# EAGLE design ibmpc (EAGLE 9.6.1)
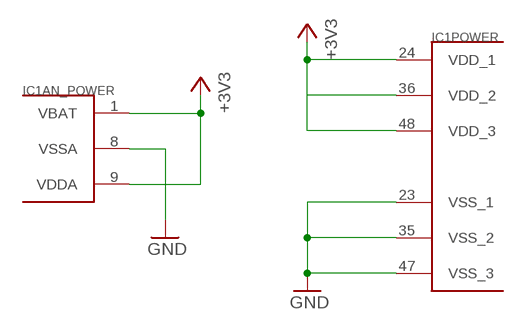
[diagram p0: schematic, sheet 1, part 1 of 2]
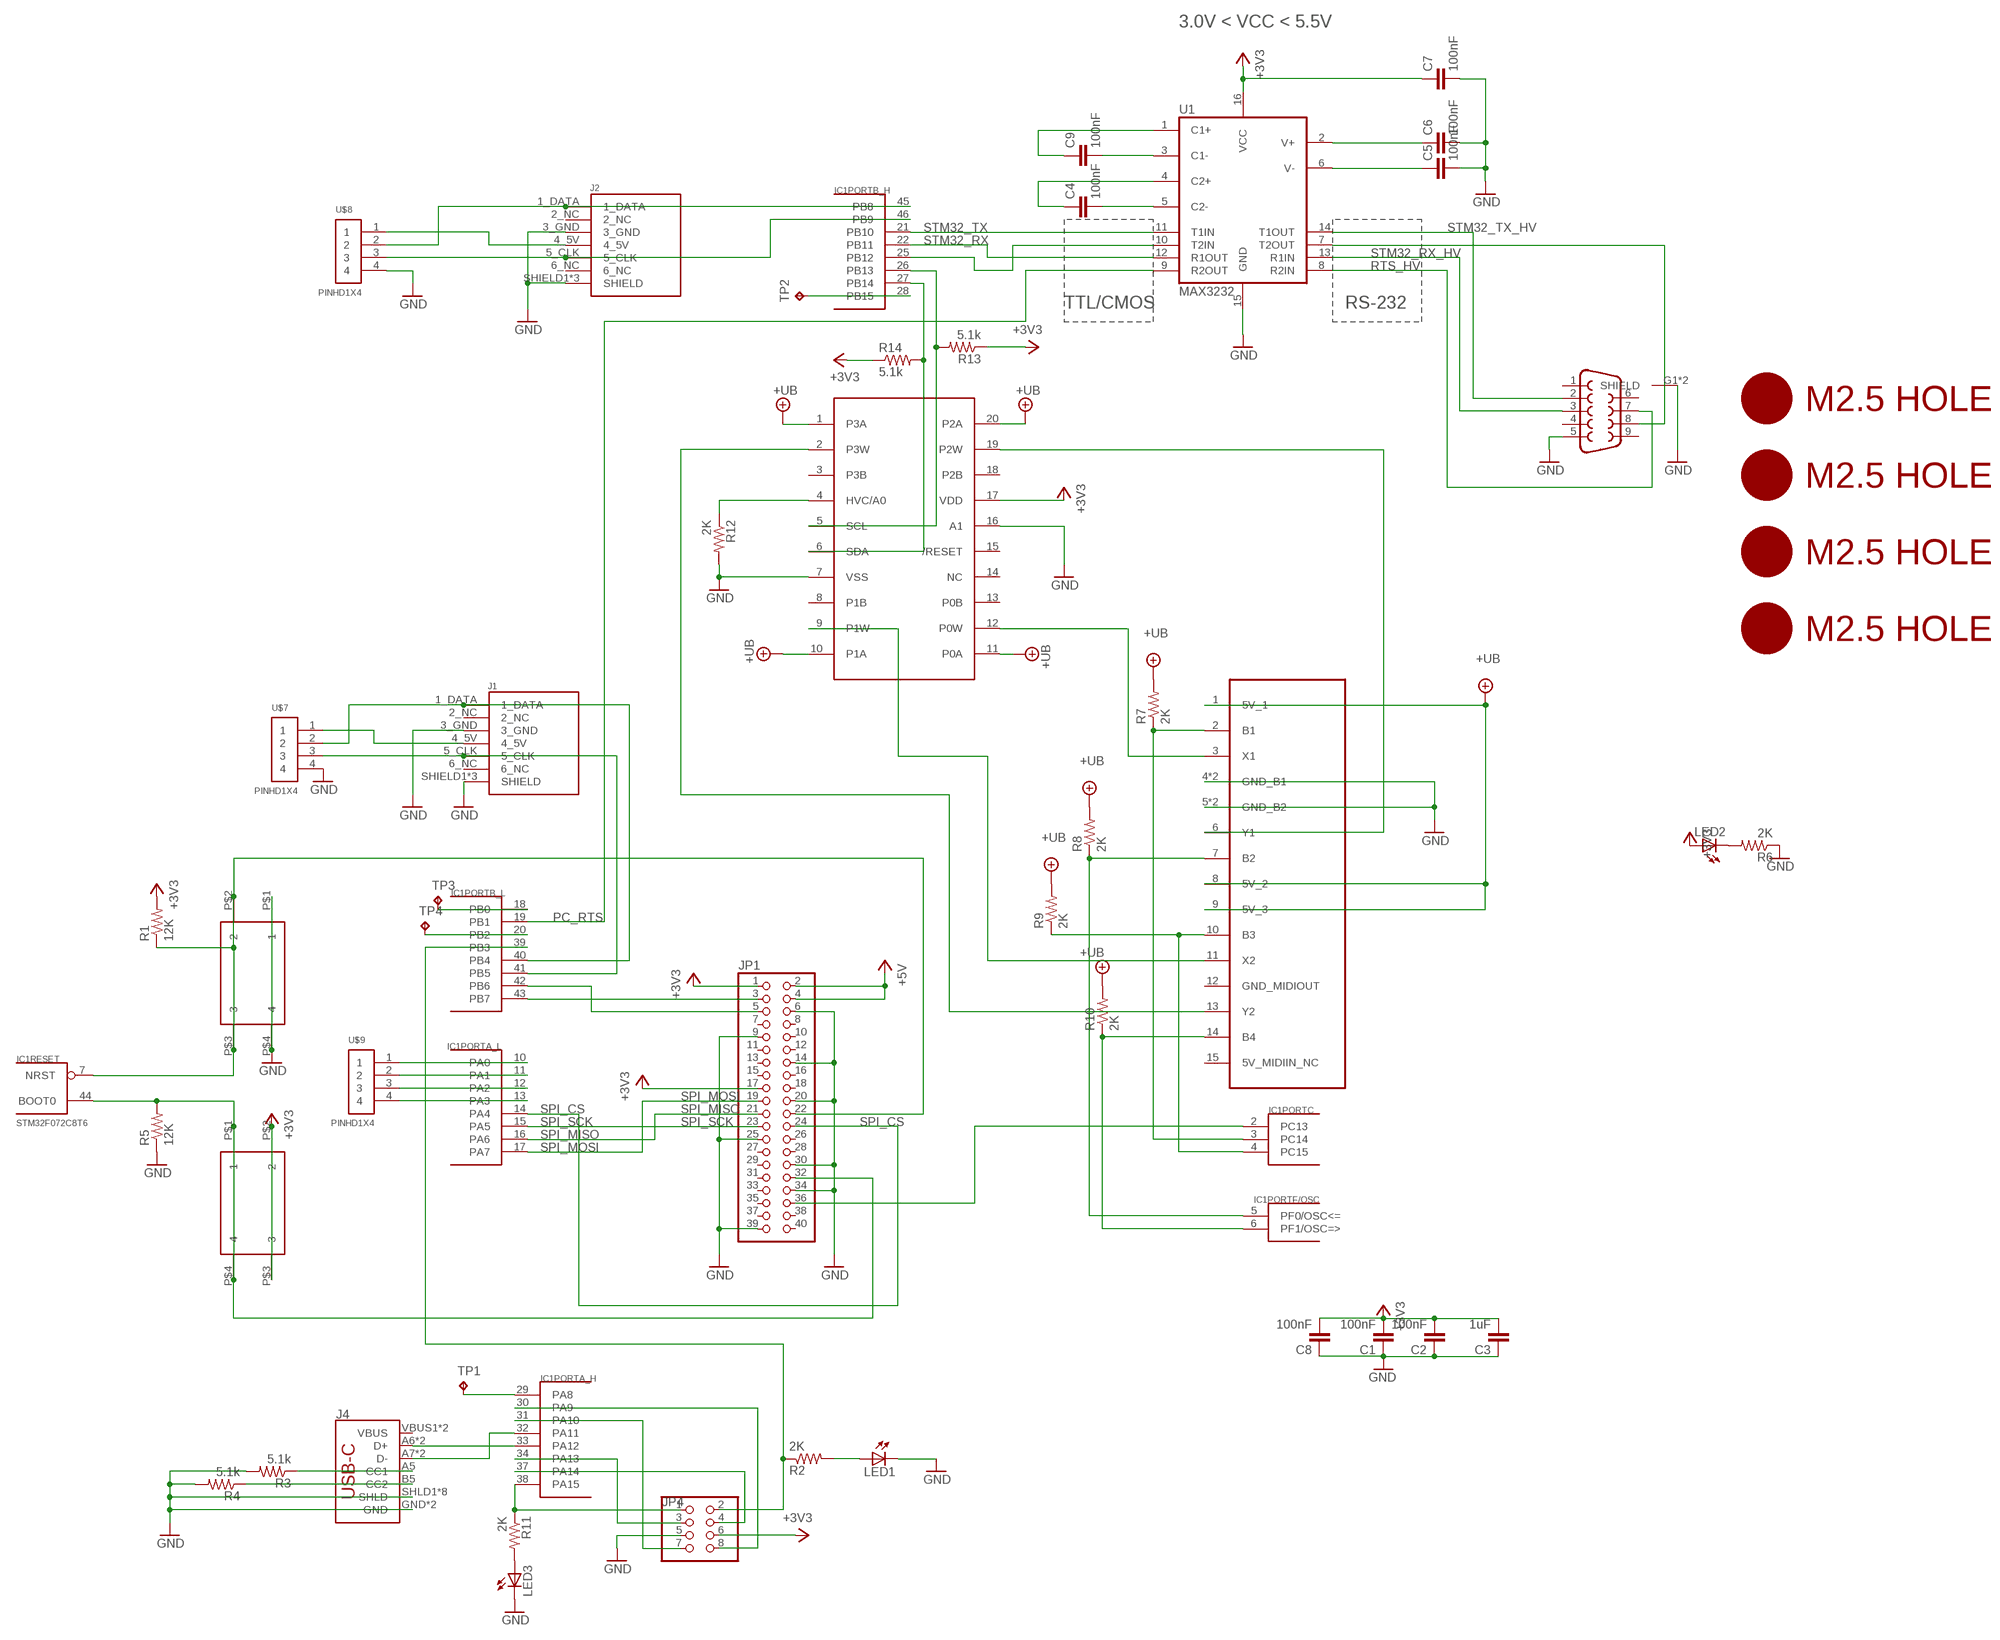
[diagram p1: schematic, sheet 1, part 2 of 2]

## Parts
C1  100nF  CAP0805  [0805@1]
C2  100nF  CAP0805  [0805@1]
C3  1uF  CAP0805  [0805@1]
C4  100nF  CAP0805  [0805@1]
C5  100nF  CAP0805  [0805@1]
C6  100nF  CAP0805  [0805@1]
C7  100nF  CAP0805  [0805@1]
C8  100nF  CAP0805  [0805@1]
C9  100nF  CAP0805  [0805@1]
IC1  STM32F072C8T6  [TQFP48]
J1  DIN7  [DIN7]
J2  DIN7  [DIN7]
J3  DB9MALE  [DB9_MALE]
J4  USB_C16PIN  [USB-C-16P]
JP1  PINHD-2X20-BIG  [2X20-BIG]
JP4  PINHD-2X4  [2X04]
LED1  LEDCHIP-LED0805  [CHIP-LED0805]
LED2  LEDCHIP-LED0805  [CHIP-LED0805]
LED3  LEDCHIP-LED0805  [CHIP-LED0805]
R1  12K  RESISTOR0805-RES  [0805]
R2  2K  RESISTOR0805-RES  [0805]
R3  5.1k  RESISTOR0805-RES  [0805]
R4  5.1k  RESISTOR0805-RES  [0805]
R5  12K  RESISTOR0805-RES  [0805]
R6  2K  RESISTOR0805-RES  [0805]
R7  2K  RESISTOR0805-RES  [0805]
R8  2K  RESISTOR0805-RES  [0805]
R9  2K  RESISTOR0805-RES  [0805]
R10  2K  RESISTOR0805-RES  [0805]
R11  2K  RESISTOR0805-RES  [0805]
R12  2K  RESISTOR0805-RES  [0805]
R13  5.1k  RESISTOR0805-RES  [0805]
R14  5.1k  RESISTOR0805-RES  [0805]
SW1  324_SW  [342_SWICH_FOOT]
SW4  324_SW  [342_SWICH_FOOT]
TP1  TPTP12R  [TP12R]
TP2  TPTP12R  [TP12R]
TP3  TPTP12R  [TP12R]
TP4  TPTP12R  [TP12R]
U1  MAX3232  MAX232SOIC16  [SO016]
U$1  GAMEPORT_15P  [DA15]
U$2  M2.5HOLE  [M2.5HOLE]
U$3  M2.5HOLE  [M2.5HOLE]
U$4  M2.5HOLE  [M2.5HOLE]
U$5  M2.5HOLE  [M2.5HOLE]
U$6  MCP4451  [TSSOP20]
U$7  PINHD1X4  [1X04-CLEANBIG]
U$8  PINHD1X4  [1X04-CLEANBIG]
U$9  PINHD1X4  [1X04-CLEANBIG]

## Nets
+3V3: C1.2 C2.2 C3.2 C7.1 C8.2 IC1.1(AN_POWER:VBAT) IC1.9(AN_POWER:VDDA) IC1.24(POWER:VDD_1) IC1.36(POWER:VDD_2) IC1.48(POWER:VDD_3) JP1.1 JP1.17 JP4.6 LED2.A R1.2 R13.1 R14.1 SW1.P$2 SW1.P$3 U1.16(VCC) U$6.17(VDD)
+5V: JP1.2 JP1.4
+UB: R7.2 R8.2 R9.2 R10.2 U$1.1(5V_1) U$1.8(5V_2) U$1.9(5V_3) U$6.1(P3A) U$6.10(P1A) U$6.11(P0A) U$6.20(P2A)
C1+: C9.1 U1.1(C1+)
C1-: C9.2 U1.3(C1-)
C2+: C4.1 U1.4(C2+)
C2-: C4.2 U1.5(C2-)
GND: C1.1 C2.1 C3.1 C5.2 C6.2 C7.2 C8.1 IC1.8(AN_POWER:VSSA) IC1.23(POWER:VSS_1) IC1.35(POWER:VSS_2) IC1.47(POWER:VSS_3) J1.3_GND J1.SHIELD1(SHIELD) J1.SHIELD2(SHIELD) J1.SHIELD3(SHIELD) J2.3_GND J2.SHIELD1(SHIELD) J2.SHIELD2(SHIELD) J2.SHIELD3(SHIELD) J3.5 J3.G1(SHIELD) J3.G2(SHIELD) J4.GND J4.GND2(GND) J4.SHLD1(SHLD) J4.SHLD2(SHLD) J4.SHLD3(SHLD) J4.SHLD4(SHLD) J4.SHLD5(SHLD) J4.SHLD6(SHLD) J4.SHLD7(SHLD) J4.SHLD8(SHLD) JP1.6 JP1.9 JP1.14 JP1.20 JP1.25 JP1.30 JP1.34 JP1.39 JP4.5 LED1.C LED3.C R3.2 R4.2 R5.1 R6.1 R12.2 SW4.P$1 SW4.P$4 U1.15(GND) U$1.4(GND_B1) U$1.5(GND_B2) U$1.G1(GND_B1) U$1.G2(GND_B2) U$6.7(VSS) U$6.16(A1) U$7.4 U$8.4
N$1: J4.A5(CC1) R3.1
N$2: LED1.A R2.2
N$3: J1.4_5V U$7.1
N$4: J2.4_5V U$8.1
N$5: IC1.41(PORTB_L:PB5) J1.5_CLK U$7.3
N$6: IC1.39(PORTB_L:PB3) JP4.2 R2.1
N$7: J4.B5(CC2) R4.1
N$8: IC1.33(PORTA_H:PA12) J4.A6(D+) J4.B6(D+)
N$9: IC1.32(PORTA_H:PA11) J4.A7(D-) J4.B7(D-)
N$10: IC1.45(PORTB_H:PB8) J2.1_DATA U$8.2
N$11: IC1.46(PORTB_H:PB9) J2.5_CLK U$8.3
N$12: IC1.31(PORTA_H:PA10) JP4.7
N$13: IC1.7(RESET:NRST) JP1.22 R1.1 SW4.P$2 SW4.P$3
N$14: IC1.30(PORTA_H:PA9) JP4.8
N$15: IC1.34(PORTA_H:PA13) JP4.3
N$16: IC1.37(PORTA_H:PA14) JP4.4
N$17: IC1.3(PORTC:PC14) R7.1 U$1.2(B1)
N$18: IC1.44(RESET:BOOT0) JP1.32 R5.2 SW1.P$1 SW1.P$4
N$19: IC1.5(PORTF/OSC:PF0/OSC<=) R8.1 U$1.7(B2)
N$20: IC1.4(PORTC:PC15) R9.1 U$1.10(B3)
N$21: IC1.6(PORTF/OSC:PF1/OSC=>) R10.1 U$1.14(B4)
N$22: IC1.42(PORTB_L:PB6) JP1.5
N$23: IC1.43(PORTB_L:PB7) JP1.3
N$24: IC1.25(PORTB_H:PB12) U1.10(T2IN)
N$25: J3.8 U1.7(T2OUT)
N$26: IC1.40(PORTB_L:PB4) J1.1_DATA U$7.2
N$27: IC1.38(PORTA_H:PA15) JP4.1 R11.1
N$28: LED3.A R11.2
N$29: LED2.C R6.2
N$30: IC1.27(PORTB_H:PB14) R14.2 U$6.6(SDA)
N$31: IC1.26(PORTB_H:PB13) R13.2 U$6.5(SCL)
N$32: R12.1 U$6.4(HVC/A0)
N$33: U$1.3(X1) U$6.12(P0W)
N$34: U$1.11(X2) U$6.9(P1W)
N$35: U$1.6(Y1) U$6.19(P2W)
N$36: U$1.13(Y2) U$6.2(P3W)
N$37: IC1.2(PORTC:PC13) JP1.36
N$38: IC1.10(PORTA_L:PA0) U$9.1
N$39: IC1.11(PORTA_L:PA1) U$9.2
N$40: IC1.12(PORTA_L:PA2) U$9.3
N$41: IC1.13(PORTA_L:PA3) U$9.4
N$42: IC1.29(PORTA_H:PA8) TP1.TP
N$43: IC1.28(PORTB_H:PB15) TP2.TP
N$44: IC1.20(PORTB_L:PB2) TP4.TP
N$45: IC1.18(PORTB_L:PB0) TP3.TP
PC_RTS: IC1.19(PORTB_L:PB1) U1.9(R2OUT)
RTS_HV: J3.7 U1.8(R2IN)
SPI_CS: IC1.14(PORTA_L:PA4) JP1.24
SPI_MISO: IC1.16(PORTA_L:PA6) JP1.21
SPI_MOSI: IC1.17(PORTA_L:PA7) JP1.19
SPI_SCK: IC1.15(PORTA_L:PA5) JP1.23
STM32_RX: IC1.22(PORTB_H:PB11) U1.12(R1OUT)
STM32_RX_HV: J3.3 U1.13(R1IN)
STM32_TX: IC1.21(PORTB_H:PB10) U1.11(T1IN)
STM32_TX_HV: J3.2 U1.14(T1OUT)
V+: C6.1 U1.2(V+)
V-: C5.1 U1.6(V-)
Unconnected: J1.2_NC J1.6_NC J2.2_NC J2.6_NC J3.1 J3.4 J3.6 J3.9 J4.VBUS1(VBUS) J4.VBUS2(VBUS) JP1.7 JP1.8 JP1.10 JP1.11 JP1.12 JP1.13 JP1.15 JP1.16 JP1.18 JP1.26 JP1.27 JP1.28 JP1.29 JP1.31 JP1.33 JP1.35 JP1.37 JP1.38 JP1.40 U$1.12(GND_MIDIOUT) U$1.15(5V_MIDIIN_NC) U$6.3(P3B) U$6.8(P1B) U$6.13(P0B) U$6.14(NC) U$6.15(/RESET) U$6.18(P2B)

## Notes on the sheet
- 3.0V < VCC < 5.5V
- TTL/CMOS | RS-232

## Library data of the parts
C1-C9 = clock:CAP: Capacitor Standard 0603 ceramic capacitor, and 0.1" leaded capacitor.
IC1 = clock:STM32F072C8T6: ST STM32F072 48pin LQFP
J1 J2 = SparkFun-Connectors:DIN7: Mini-DIN7 Connector Through-hole MiniDIN 7 connector. Commonly used with Roomba products. Don't confuse this with DIN-6, which is commonly used on oldschool keyboards and mice. Here is the female version connector we sell at SparkFun: MiniDIN 7-Pin Connector <https://www.sparkfun.com/products/696> (PRT-00696); PROD_ID: CONN-08318; SF_ID: PRT-00696
J3 = SparkFun-Connectors:DB9: DB9 Connector Standard DB9 (D-Sub 9) serial connector. Can be used for CAN bus as well as RS485 and RS232. Footprint production proven. Here is the female version connector we sell at SparkFun: 9 Pin Female Serial Connector - PCB Mount <https://www.sparkfun.com/products/429> (PRT-00429) This connector has been used on the following SparkFun products: SparkFun RS232 Shifter - SMD <https://www.sparkfun.com/products/449> (PRT-00449) SparkFun RS232 Shifter SMD (No DB9) <https://www.sparkfun.com/products/8780> (PRT-08780); PROD_ID: CONN-09904
J4 = SparkFun-Connectors:USB_C: USB Type C 16Pin Connector Super Speed pins not available on the 16-pin purely SMD connector so this part is best for USB 2.0 implementations. D1 and D2 are tied together enabling D+/- no matter which way the cable is plugged into the connector. The two channel configuration pins (CC1/2) are exposed. These are normally connected to ground via 5.1k resistors but can be reconfigured for high current/high power applications.; PROD_ID: CONN-14122
JP1 = adafruit_changed:PINHD-2X20: PIN HEADER
JP4 = pinhead:PINHD-2X4: PIN HEADER
LED1-LED3 = adafruit:LED: LED OSRAM: - CHIPLED LG R971, LG N971, LY N971, LG Q971, LY Q971, LO R971, LY R971 LH N974, LH R974 LS Q976, LO Q976, LY Q976 LO Q996 - Hyper CHIPLED LW Q18S LB Q993, LB Q99A, LB R99A - SideLED LS A670, LO A670, LY A670, LG A670, LP A670 LB A673, LV A673, LT A673, LW A673 LH A674 LY A675 LS A676, LA A676, LO A676, LY A676, LW A676 LS A679, LY A679, LG A679 - Hyper Micro SIDELED® LS Y876, LA Y876, LO Y876, LY Y876 LT Y87S - SmartLED LW L88C, LW L88S LB L89C, LB L89S, LG L890 LS L89K, LO L89K, LY L89K LS L896, LA L896, LO L896, LY L896 - TOPLED LS T670, LO T670, LY T670, LG T670, LP T670 LSG T670, LSP T670, LSY T670, LOP T670, LYG T670 LG T671, LOG T671, LSG T671 LB T673, LV T673, LT T673, LW T673 LH T674 LS T676, LA T676, LO T676, LY T676, LB T676, LH T676, LSB T676, LW T676 LB T67C, LV T67C, LT T67C, LS T67K, LO T67K, LY T67K, LW E67C LS E67B, LA E67B, LO E67B, LY E67B, LB E67C, LV E67C, LT E67C LW T67C LS T679, LY T679, LG T679 LS T770, LO T770, LY T770, LG T770, LP T770 LB T773, LV T773, LT T773, LW T773 LH T774 LS E675, LA E675, LY E675, LS T675 LS T776, LA T776, LO T776, LY T776, LB T776 LHGB T686 LT T68C, LB T68C - Hyper Mini TOPLED® LB M676 - Mini TOPLED Santana® LG M470 LS M47K, LO M47K, LY M47K Source: http://www.osram.convergy.de/
R1-R14 = SparkFun-Passives:RESISTOR: Resistor Basic schematic elements and footprints for 0603, 1206, and PTH resistors.
SW1 SW4 = 3pos_slide_switch_centered:324_SW
TP1-TP4 = testpad:TP: Test pad
U1 = SparkFun-DigitalIC:MAX232: RS232 Transceiver Very common IC. This is generically called 'MAX232', but works with the 3V equivalent MAX3232 generic ICs. Field tested and mother approved. Spark Fun Electronics SKU : COM-00316 (DIP) and COM-00589 (SMD); PROD_ID: IC-08171
U$1 = ibmpc:GAMEPORT_15P
U$2-U$5 = f1c100s:M2.5HOLE
U$6 = ps2:MCP4451
U$7-U$9 = adafruit_changed:PINHD1X4

## Net classes
1 power: width 0.178 mm

## Board
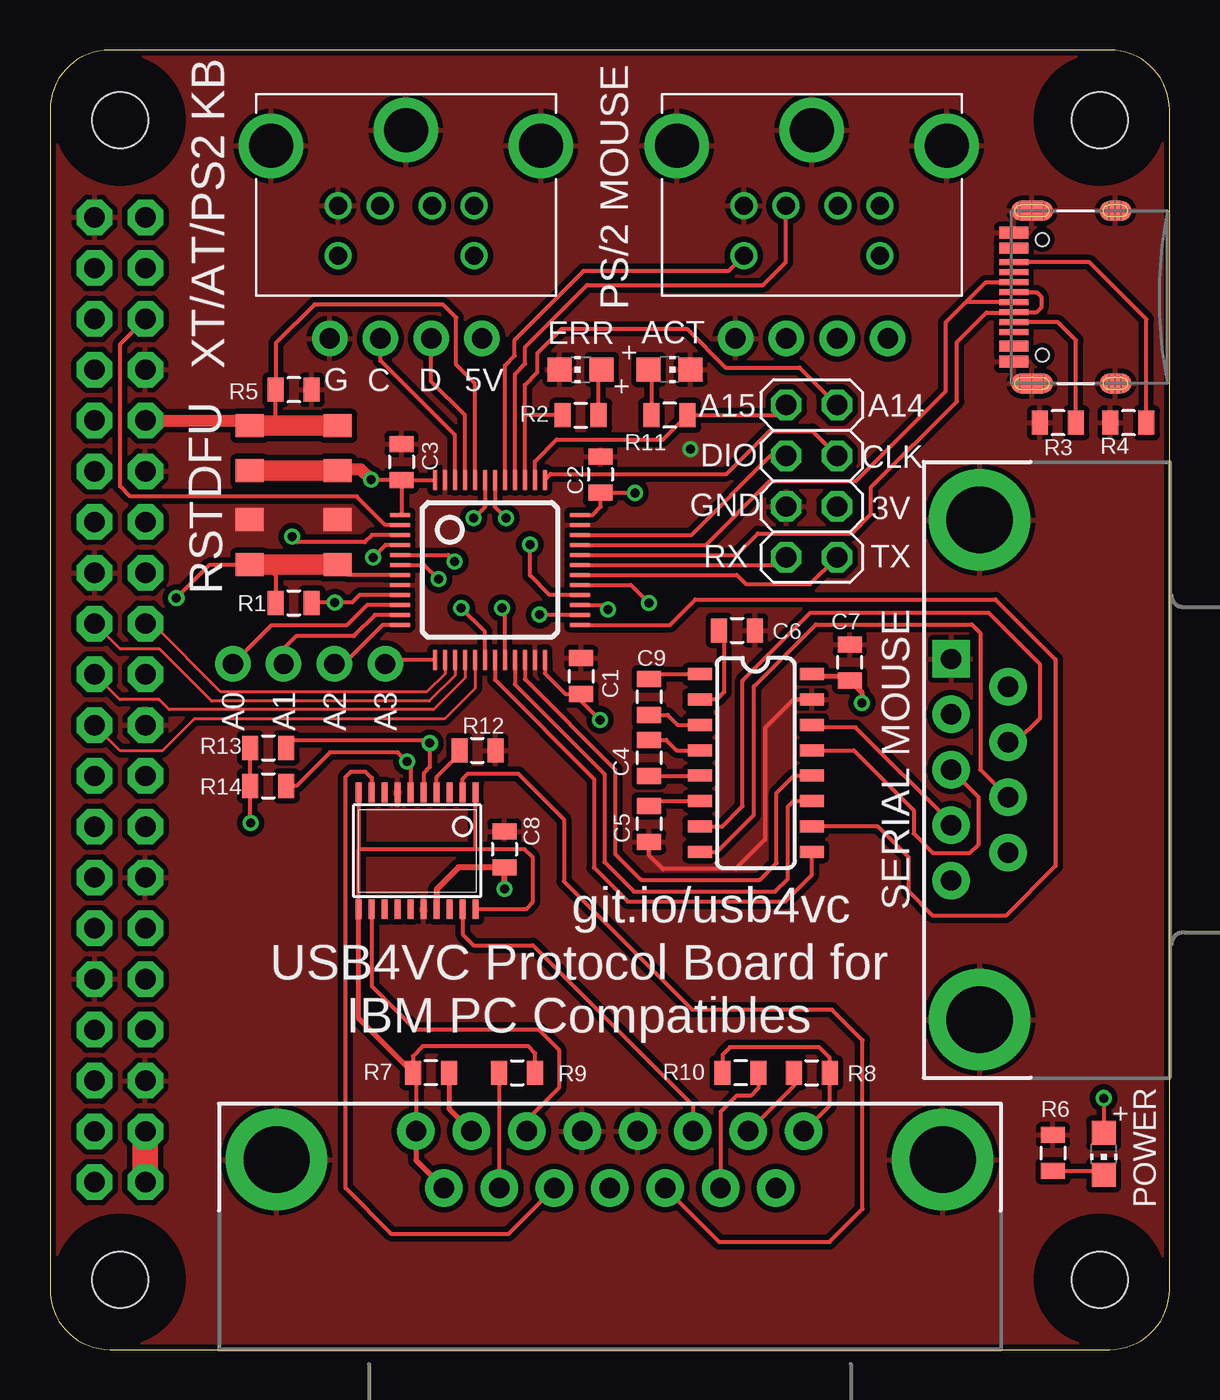
[diagram p2: board, top side]
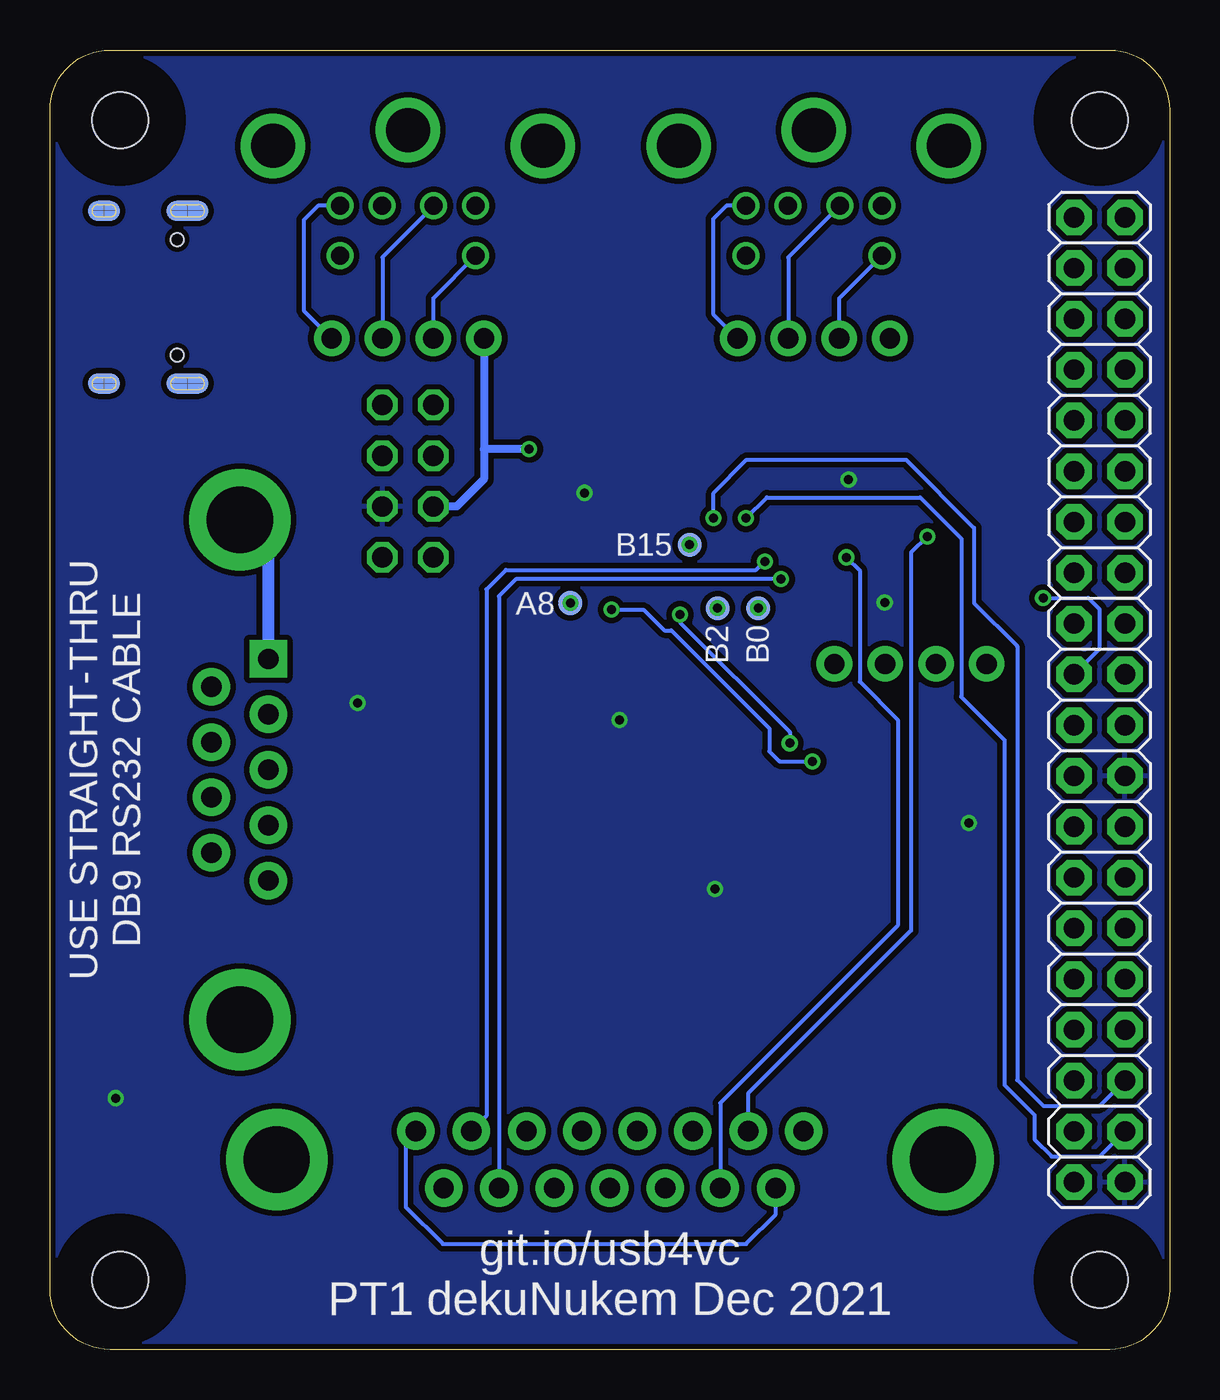
[diagram p3: board, bottom side, seen from below]

Size 56 x 65 mm. Coordinates in mm from the lower left corner, seen from the top.
Outline: 3,0 53,0 arc90 56,3 56,62 arc90 53,65 3,65 arc90 0,62 0,3 arc90 3,0
Copper layers (1*16): Top 0.035mm / dielectric 1.5mm / Bottom 0.035mm
Design rules "deku_2layer_6mil": minimum track width 6mil, minimum drill 15mil, track to track 6mil, track to pad 6mil, pad to pad 6mil, via to via 6mil, smd to smd 6mil, copper to edge 10mil, drill to drill 6mil, minimum pad ring 7mil, minimum via ring 7mil, stop-mask expansion 4mil, vias tented up to drill 25mil, thermal gap 10mil

### Footprints (pad centres in the part's own frame; a part is rotated, then mirrored left to right if it is on the bottom)
0805@1 = smd 0.8 x 1.2: 1 -0.9,0; 2 0.9,0
TQFP48 = smd 0.2 x 1: 1 -2.75,-4.5; 2 -2.25,-4.5; 3 -1.75,-4.5; 4 -1.25,-4.5; 5 -0.75,-4.5; 6 -0.25,-4.5; 7 0.25,-4.5; 8 0.75,-4.5; 9 1.25,-4.5; 10 1.75,-4.5; 11 2.25,-4.5; 12 2.75,-4.5; 25 2.75,4.5; 26 2.25,4.5; 27 1.75,4.5; 28 1.25,4.5; 29 0.75,4.5; 30 0.25,4.5; 31 -0.25,4.5; 32 -0.75,4.5; 33 -1.25,4.5; 34 -1.75,4.5; 35 -2.25,4.5; 36 -2.75,4.5 | smd 1 x 0.2: 13 4.5,-2.75; 14 4.5,-2.25; 15 4.5,-1.75; 16 4.5,-1.25; 17 4.5,-0.75; 18 4.5,-0.25; 19 4.5,0.25; 20 4.5,0.75; 21 4.5,1.25; 22 4.5,1.75; 23 4.5,2.25; 24 4.5,2.75; 37 -4.5,2.75; 38 -4.5,2.25; 39 -4.5,1.75; 40 -4.5,1.25; 41 -4.5,0.75; 42 -4.5,0.25; 43 -4.5,-0.25; 44 -4.5,-0.75; 45 -4.5,-1.25; 46 -4.5,-1.75; 47 -4.5,-2.25; 48 -4.5,-2.75
DIN7 = drill 0.9: 1_DATA -1.3,-3.8; 2_NC 1.3,-3.8; 3_GND -3.4,-3.8; 4_5V 3.4,-3.8; 5_CLK -3.4,-6.3; 6_NC 3.4,-6.3 | drill 2.2: SHIELD1 -6.75,-0.8; SHIELD2 0,0; SHIELD3 6.75,-0.8
DB9_MALE = drill 1.016 pad 1.88: 1 5.54,-1.42; 2 2.77,-1.42; 3 0,-1.42; 4 -2.77,-1.42; 6 4.15,1.42; 7 1.38,1.42; 8 -1.38,1.42; 9 -4.15,1.42 | drill 1.016 pad 1.88 square: 5 -5.54,-1.42 | drill 3.302 pad 5.08: G1 -12.5,0; G2 12.5,0
USB-C-16P = smd 0.3 x 1.45: A5 -1.25,0; A6 -0.25,0; A7 0.25,0; A8 1.25,0; B5 1.75,0; B6 0.75,0; B7 -0.75,0; B8 -1.75,0 | smd 0.6 x 1.45: GND -3.225,0; GND2 3.225,0 | smd 1 x 2.1: SHLD1 -4.32,-0.915; SHLD2 4.32,-0.915 | smd 1 x 2.1 bottom: SHLD3 -4.32,-0.915; SHLD4 4.32,-0.915 | smd 1 x 1.6: SHLD5 -4.32,-5.095; SHLD8 4.32,-5.095 | smd 1 x 1.6 bottom: SHLD6 -4.32,-5.095; SHLD7 4.32,-5.095 | smd 0.55 x 1.45: VBUS1 -2.45,0; VBUS2 2.45,0 | hole 0.65: -2.89,-1.445; 2.89,-1.445
2X20-BIG = drill 1.016 pad 1.778 octagon: 1 -24.13,-1.27; 2 -24.13,1.27; 3 -21.59,-1.27; 4 -21.59,1.27; 5 -19.05,-1.27; 6 -19.05,1.27; 7 -16.51,-1.27; 8 -16.51,1.27; 9 -13.97,-1.27; 10 -13.97,1.27; 11 -11.43,-1.27; 12 -11.43,1.27; 13 -8.89,-1.27; 14 -8.89,1.27; 15 -6.35,-1.27; 16 -6.35,1.27; 17 -3.81,-1.27; 18 -3.81,1.27; 19 -1.27,-1.27; 20 -1.27,1.27; 21 1.27,-1.27; 22 1.27,1.27; 23 3.81,-1.27; 24 3.81,1.27; 25 6.35,-1.27; 26 6.35,1.27; 27 8.89,-1.27; 28 8.89,1.27; 29 11.43,-1.27; 30 11.43,1.27; 31 13.97,-1.27; 32 13.97,1.27; 33 16.51,-1.27; 34 16.51,1.27; 35 19.05,-1.27; 36 19.05,1.27; 37 21.59,-1.27; 38 21.59,1.27; 39 24.13,-1.27; 40 24.13,1.27
2X04 = drill 1.016 octagon: 1 -3.81,-1.27; 2 -3.81,1.27; 3 -1.27,-1.27; 4 -1.27,1.27; 5 1.27,-1.27; 6 1.27,1.27; 7 3.81,-1.27; 8 3.81,1.27
CHIP-LED0805 = smd 1.2 x 1.2: A 0,-1.05; C 0,1.05
0805 = smd 0.8 x 1.2: 1 -0.9,0; 2 0.9,0
342_SWICH_FOOT = smd 1.4 x 1.15: P$1 -2.2,-1.125; P$2 -2.2,1.125; P$3 2.2,1.125; P$4 2.2,-1.125
TP12R = smd 1.2 x 1.2: TP 0,0
SO016 = smd 0.6 x 1.2: 1 -4.445,-2.8; 2 -3.175,-2.8; 3 -1.905,-2.8; 4 -0.635,-2.8; 5 0.635,-2.8; 6 1.905,-2.8; 7 3.175,-2.8; 8 4.445,-2.8; 9 4.445,2.8; 10 3.175,2.8; 11 1.905,2.8; 12 0.635,2.8; 13 -0.635,2.8; 14 -1.905,2.8; 15 -3.175,2.8; 16 -4.445,2.8
DA15 = drill 1.016 pad 1.88: 1 9.69,-1.42; 2 6.92,-1.42; 3 4.15,-1.42; 4 1.38,-1.42; 5 -1.39,-1.42; 6 -4.16,-1.42; 7 -6.93,-1.42; 8 -9.7,-1.42; 9 8.3,1.42; 10 5.53,1.42; 11 2.77,1.42; 12 0,1.42; 13 -2.77,1.42; 14 -5.54,1.42; 15 -8.31,1.42 | drill 3.302 pad 5.08: G1 -16.66,0; G2 16.67,0
M2.5HOLE = hole 2.8: 0,0
TSSOP20 = smd 0.305 x 0.991: 1 -2.925,-2.918; 2 -2.275,-2.918; 3 -1.625,-2.918; 4 -0.975,-2.918; 5 -0.325,-2.918; 6 0.325,-2.918; 7 0.975,-2.918; 8 1.625,-2.918; 9 2.275,-2.918; 10 2.925,-2.918; 11 2.925,2.918; 12 2.275,2.918; 13 1.625,2.918; 14 0.975,2.918; 15 0.325,2.918; 16 -0.325,2.918; 17 -0.975,2.918; 18 -1.625,2.918; 19 -2.275,2.918; 20 -2.925,2.918
1X04-CLEANBIG = drill 1.016 pad 1.778: 1 -3.81,0; 2 -1.27,0; 3 1.27,0; 4 3.81,0

### Placement (x,y rotation side)
C1  26.57,33.68 270 top
C2  27.53,43.76 270 top
C3  17.58,44.4 270 top
C4  29.97,29.59 270 top
C5  29.97,26.29 270 top
C6  34.37,35.97 0 top
C7  40.01,34.37 90 top
C8  22.73,25.02 270 top
C9  29.97,32.64 270 top
IC1  22,39 270 top
J1  38.1,61 0 top
J2  17.8,61 0 top
J3  46.5,29 270 top
J4  48.2,52.63 90 top
JP1  3.5,32.5 90 bottom
JP4  38.1,43.43 270 top
LED1  26.54,49.02 90 top
LED2  52.7,9.78 180 top
LED3  30.99,49.02 270 top
R1  12.19,37.34 0 top
R2  26.54,46.74 0 top
R3  50.42,46.35 180 top
R4  53.95,46.35 180 top
R5  12.19,48.01 180 top
R6  50.16,9.83 270 top
R7  19.05,13.84 180 top
R8  38.1,13.84 0 top
R9  23.37,13.84 0 top
R10  34.54,13.84 180 top
R11  30.99,46.74 180 top
R12  21.39,29.97 0 top
R13  10.92,30.1 0 top
R14  10.92,28.19 0 top
SW1  12.19,45.09 180 top
SW4  12.19,40.39 180 top
TP1  29.97,37.34 0 bottom
TP2  24,40.26 0 bottom
TP3  20.57,37.08 0 bottom
TP4  22.61,37.08 0 bottom
U1  35.31,29.34 270 top
U$1  28,9.5 180 top
U$2  3.5,3.5 0 top
U$3  52.5,3.5 0 top
U$4  3.5,61.5 0 top
U$5  52.5,61.5 0 top
U$6  18.36,24.94 180 top
U$7  38.1,50.57 180 top
U$8  17.8,50.57 180 top
U$9  12.95,34.29 0 top

### Tracks (layer width: path | path; a pad name or v marks a point on that pad's centre or on a via)
+3V3  (via drill 0.45)
  Top 0.203: v16.05,43.51 17.57,43.51 C3.2 | C3.2 IC1.48 | C3.2 17.58,41.83 IC1.1 | v27.51,31.5 26.57,32.44 C1.2 25.79,32.78 24.75,33.82 IC1.24 | R1.2 13.12,37.36 v14.25,37.36 15.11,37.36 15.5,37.75 IC1.9 | v29.26,42.85 27.55,42.85 | 27.55,42.85 C2.2 | IC1.36 27.14,41.75 27.55,42.15 27.55,42.85 | v52.7,12.57 LED2.A | v10.03,26.34 v10.02,26.35 R14.1 R13.1
  Top 0.254: U1.16 38.35,33.78 38.48,33.66 39.82,33.66 C7.1 40.62,32.86 v40.62,32.33
  Top 0.305: v22.73,23.04 C8.2 20.44,24.12 19.34,23.02 U$6.17
  Top 0.61: v16.05,43.51 15.54,44.02 14.45,44.02 SW1.P$2
  Top 1.016: SW1.P$3 SW1.P$2
  pour Bottom (isolate 0.279, rank 2): 0,3 0,62 arc-90 3,65 53,65 arc-90 56,62 56,3 arc-90 53,0 3,0 arc-90
+5V
  Top 1.27: JP1.4 JP1.2
+UB
  Top 0.203: U$6.20 23.8,22.02 24.13,22.35 24.13,24.64 23.75,25.02 21.29,25.02 | R9.2 24.27,14.82 23.93,15.16 18.64,15.16 18.15,14.67 R7.2 18.31,13.68 U$1.1 | 21.29,25.02 15.44,25.02 | U$6.10 15.44,25.02 | 21.29,25.02 U$6.1 | U$1.8 39,12.22 R8.2 39,14.59 38.48,15.11 34.01,15.11 33.64,14.75 R10.2 | U$6.11 15.44,25.02
  Top 0.254: R7.2 15.44,16.55 U$6.11 | U$1.1 18.31,9.47 U$1.9
  Bottom 0.203: U$1.8 38.2,10.42 38.2,7.14 36.35,5.28 21.18,5.28 19.7,6.77 U$1.9
C1+
  Top 0.203: C9.1 30.21,33.78 U1.1
C1-
  Top 0.203: C9.2 30.9,31.74 31.39,31.24 U1.3
C2+
  Top 0.203: C4.1 30.82,30.49 31.34,29.97 U1.4
C2-
  Top 0.203: C4.2 32.49,28.69 U1.5
GND  (via drill 0.45)
  Top 0.203: U1.15 37.19,32.51 35.76,31.09 35.76,25.5 34.29,24.03 30.66,24.03 29.97,24.71 C5.2
  Bottom 0.406: U$7.4 34.29,45.03 | 34.29,45.03 34.29,43.54 35.66,42.16 JP4.5 | v32.03,45.03 34.29,45.03
  Bottom 0.61: J3.G1 45.08,40.08 J3.5
  pour Top (isolate 0.279): 3,0 53,0 arc90 56,3 56,62 arc90 53,65 3,65 arc90 0,62 0,3 arc90
N$1
  Top 0.203: R3.1 51.32,50.48 50.42,51.38 J4.A5
N$2
  Top 0.203: R2.2 27.44,48.87 LED1.A
N$3
  Bottom 0.203: J1.4_5V 42.6,57.2 43.31,56.49 43.31,51.97 U$7.1
N$4
  Bottom 0.203: J2.4_5V 22.18,57.2 22.84,56.54 22.84,51.8 U$8.1
N$5
  Top 0.203: IC1.41 22.75,49.22 23.24,49.71 23.24,50.49 26.68,53.94 33.94,53.94 J1.5_CLK
  Bottom 0.203: J1.5_CLK 36.83,52.57 U$7.3
N$6
  Top 0.203: JP4.2 37.49,49.12 33.78,49.12 31.85,51.05 25.6,51.05 24.38,49.84 24.38,48.88 23.75,48.25 23.75,46.74 | IC1.39 23.75,46.74 | R2.1 23.75,46.74
N$7
  Top 0.203: R4.1 54.85,51.53 51.99,54.38 J4.B5
N$8
  Top 0.203: IC1.33 32.81,40.25 35.99,43.43 40.31,43.43 44.81,47.93 44.81,51.38 45.77,52.35 45.81,52.38 | J4.B6 46.81,53.38 45.81,52.38 | J4.A6 45.81,52.38
N$9
  Top 0.152: 48.22,51.87 J4.B7
  Top 0.203: IC1.32 34.34,39.75 35.41,40.82 40.11,40.82 41.07,41.78 41.07,43.13 45.36,47.42 45.36,50.39 46.84,51.87 48.22,51.87 49.33,51.87 49.58,52.12 49.58,52.65 49.35,52.88 J4.A7
N$10
  Top 0.203: IC1.45 20.75,46.74 19.07,48.42 U$8.2
  Bottom 0.203: J2.1_DATA 19.07,54.63 U$8.2
N$11
  Top 0.203: IC1.46 20.25,45.74 16.53,49.46 U$8.3
  Bottom 0.203: J2.5_CLK 16.53,52.57 U$8.3
N$12
  Top 0.203: IC1.31 36.46,39.25 JP4.7
N$13  (via drill 0.45)
  Top 0.203: IC1.7 14.9,38.75 SW4.P$2 | 10.74,39.26 11.29,38.71 R1.1 | v6.33,37.59 7.99,39.26 SW4.P$3
  Top 1.016: SW4.P$3 10.74,39.26 SW4.P$2
  Bottom 0.203: JP1.22 3.5,35.03 3.5,37.03 4.06,37.59 v6.33,37.59
N$14
  Top 0.203: IC1.30 34.35,38.75 34.82,38.28 38.02,38.28 JP4.8
N$15
  Top 0.203: IC1.34 32.09,40.75 36.04,44.7 JP4.3
N$16
  Top 0.203: IC1.37 25.04,43.79 33.83,43.79 35.99,45.95 38.12,45.95 JP4.4
N$17  (via drill 0.45)
  Top 0.203: IC1.3 16.11,40.75 15.75,40.39 12.39,40.39 v12.12,40.66
  Top 0.254: R7.1 19.95,12.05 U$1.2
  Bottom 0.203: v12.12,40.66 12.93,39.85 12.93,20.95 21.08,12.8 U$1.2
N$18
  Top 0.203: 11.28,46.21 11.28,47.99 R5.2 11.29,50.33 13.23,52.27 19.66,52.27 20.32,51.61 20.32,49.25 21.25,48.32 IC1.44
  Top 0.61: JP1.32 9.73,46.47 SW1.P$4
  Top 1.016: SW1.P$4 11.28,46.21 SW1.P$1
N$19  (via drill 0.45)
  Top 0.203: R8.1 37.2,13.19 U$1.7 | IC1.5 19.91,39.75 v20.24,39.42
  Bottom 0.203: v20.24,39.42 20.68,38.99 33.2,38.99 34.17,38.02 34.17,11.68 U$1.7
N$20  (via drill 0.45)
  Top 0.203: R9.1 U$1.10 | IC1.4 16.78,40.25 v16.15,39.62
  Bottom 0.203: v16.15,39.62 15.49,38.96 15.49,33.4 13.59,31.5 13.59,21.21 22.47,12.33 U$1.10
N$21  (via drill 0.45)
  Top 0.203: U$1.14 33.54,11.9 34.34,12.7 35.05,12.7 35.44,13.09 R10.1 | IC1.6 18.71,39.25 v19.43,38.53
  Bottom 0.203: v19.43,38.53 32.69,38.53 33.54,37.68 U$1.14
N$22  (via drill 0.45)
  Top 0.203: IC1.42 22.25,42.14 v22.81,41.58
  Bottom 0.203: v22.81,41.58 22.81,42.85 21.16,44.5 13.18,44.5 9.78,41.1 9.78,37.34 7.62,35.18 7.62,13.49 6.33,12.19 3.49,12.19 JP1.5
N$23  (via drill 0.45)
  Top 0.203: IC1.43 21.75,42.15 v21.18,41.58
  Bottom 0.203: v21.18,41.58 20.14,42.62 12.47,42.62 10.41,40.56 10.41,32.64 8.26,30.48 8.26,13.23 6.76,11.73 6.76,10.52 5.89,9.65 3.49,9.65 JP1.3
N$24
  Top 0.203: IC1.25 31.02,36.25 32.28,37.52 47.3,37.52 50.29,34.52 50.29,24.18 47.8,21.69 44.17,21.69 42.95,22.91 42.95,24.61 41.4,26.16 U1.10
N$25
  Top 0.203: U1.7 33.63,26.16 34.65,27.18 34.65,33.45 38.05,36.85 46.94,36.85 49.51,34.29 49.51,31.57 48.31,30.38 J3.8
N$26
  Top 0.203: IC1.40 23.25,48.78 23.77,49.3 23.77,50.14 26.87,53.24 35.66,53.24 36.8,54.38 J1.1_DATA
  Bottom 0.203: J1.1_DATA 39.37,54.63 U$7.2
N$27
  Top 0.203: IC1.38 24.25,44.42 25.35,45.52 30.67,45.52 R11.1 36.32,46.74 JP4.1
N$28
  Top 0.203: LED3.A 30.09,48.87 R11.2
N$29
  Top 0.203: R6.2 52.5,8.93 LED2.C
N$30  (via drill 0.45)
  Top 0.203: IC1.27 27.67,37.25 v27.91,37.01 | U$6.6 18.04,29.23 v17.86,29.41 17.4,29.87 14.01,29.87 12.33,28.19 R14.2
  Bottom 0.203: v27.91,37.01 26.31,37.01 25.27,35.97 24.92,35.97 20.02,31.06 20.02,29.92 19.51,29.41 v17.86,29.41
N$31  (via drill 0.45)
  Top 0.203: IC1.26 v24.49,36.75 | U$6.5 18.69,28.82 19,29.13 v19,30.33 18.87,30.45 12.18,30.45 R13.2
  Bottom 0.203: v24.49,36.75 24.49,36.37 19,30.89 v19,30.33
N$32
  Top 0.203: U$6.4 19.34,28.64 20.49,29.78 R12.1
N$33
  Top 0.203: U$6.12 16.09,18.18 18.26,16 24.43,16 25.45,14.99 25.45,13.08 23.85,11.48 U$1.3
N$34
  Top 0.203: U$6.9 16.09,28.59 15.77,28.91 15.06,28.91 14.78,28.63 14.78,8.08 17.09,5.77 22.92,5.77 U$1.11
N$35
  Top 0.203: U$6.19 20.64,20.76 21.18,20.22 24.16,20.22 32.16,12.21 U$1.6
N$36
  Top 0.203: U$6.2 20.64,28.54 20.9,28.8 23.42,28.8 25.7,26.52 25.7,23.42 32.13,16.99 39.12,16.99 40.64,15.47 40.64,7.04 38.99,5.38 33.47,5.38 U$1.13
N$37
  Top 0.203: IC1.2 16.76,41.25 15.34,42.67 4.01,42.67 3.5,43.18 3.5,50.28 JP1.36
N$38
  Top 0.203: IC1.10 15.86,37.25 14.83,36.22 11.07,36.22 U$9.1
N$39
  Top 0.203: IC1.11 16.25,36.75 15.19,35.69 12.32,35.69 11.68,35.05 U$9.2
N$40
  Top 0.203: IC1.12 16.64,36.25 14.68,34.29 U$9.3
N$41
  Top 0.203: IC1.13 16.97,34.5 U$9.4
N$42  (via drill 0.45)
  Top 0.203: IC1.29 29.06,38.25 TP1.TP
  other vias: 29.97,37.34
N$43  (via drill 0.45)
  Top 0.203: IC1.28 24.99,37.75 24,38.73 TP2.TP
  other vias: 24,40.26
N$44  (via drill 0.45)
  Top 0.203: IC1.20 22.75,36.94 TP4.TP
  other vias: 22.61,37.08
N$45  (via drill 0.45)
  Top 0.203: IC1.18 21.75,35.91 TP3.TP
  other vias: 20.57,37.08
PC_RTS
  Top 0.203: IC1.19 22.25,33.5 27.2,28.55 27.2,24.11 28.91,22.4 36.78,22.4 38.11,23.73 U1.9
RTS_HV
  Top 0.203: U1.8 33.35,24.89 35.2,26.75 35.2,33.17 38.3,36.27 46.1,36.27 46.53,35.84 46.53,29.01 J3.7
SPI_CS
  Top 0.152: IC1.14 19.75,33.8 18.85,32.89 8.54,32.89 5.13,36.31 JP1.24
SPI_MISO
  Top 0.152: IC1.16 20.75,33.58 19.18,32 5.97,32 5.46,32.51 3.49,32.51 JP1.21
SPI_MOSI
  Top 0.152: JP1.19 3.51,29.95 5.61,29.95 7.21,31.55 19.74,31.55 21.25,33.06 IC1.17
SPI_SCK
  Top 0.152: IC1.15 20.25,33.71 18.97,32.44 8.08,32.44 5.49,35.03 3.51,35.03 JP1.23
STM32_RX
  Top 0.203: IC1.22 23.75,33.53 28.27,29.01 28.27,24.79 29.57,23.5 35.51,23.5 36.35,24.33 36.35,27.84 37.21,28.7 U1.12
STM32_RX_HV
  Top 0.203: J3.3 46.46,27.62 46.46,25.27 46.02,24.84 44.17,24.84 43.2,25.81 43.2,26.98 40.21,29.97 U1.13
STM32_TX
  Top 0.203: IC1.21 23.25,33.27 27.74,28.78 27.74,24.38 29.21,22.91 36.27,22.91 36.91,23.55 36.91,27.15 37.19,27.43 U1.11
STM32_TX_HV
  Top 0.203: U1.14 38.23,31.11 40.3,31.11 45.08,26.33 J3.2
V+
  Top 0.203: U1.2 33.35,32.51 33.72,32.88 33.72,35.71 C6.1
V-
  Top 0.203: C5.1 30.21,27.43 U1.6

### Text on the board
tNames: PS/2 MOUSE | XT/AT/PS2 KB | ERR | ACT | G | C | D | 5V | A15 | A14 | DFU | DIO | CLK | GND | 3V | RST | RX | TX | A0 | A1 | A2 | A3 | SERIAL MOUSE | git.io/usb4vc | USB4VC Protocol Board for / IBM PC Compatibles | POWER
bNames: B15 | A8 | B0 | B2 | USE STRAIGHT-THRU / DB9 RS232 CABLE | git.io/usb4vc / PT1 dekuNukem Dec 2021